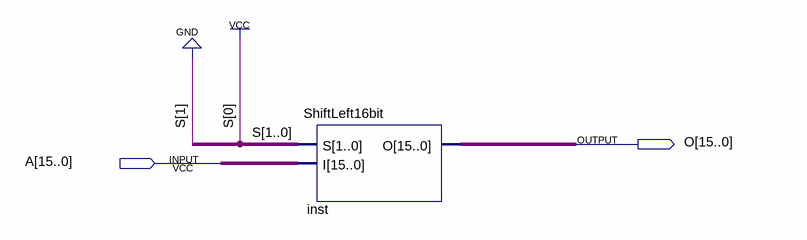
[diagram p0: schematic sheet]
// Quartus schematic Multi2.bdf as structural Verilog: 1 symbols, 2 pins
module Multi2 (
  input  [15:0] A,
  output [15:0] O
);

  ShiftLeft16bit inst (.S(2'b01), .I(A), .O(O));
endmodule
